# Altium schematic sheet Heater_Driver.SchDoc
size A4; SheetNumber: 6; SheetTotal: 8
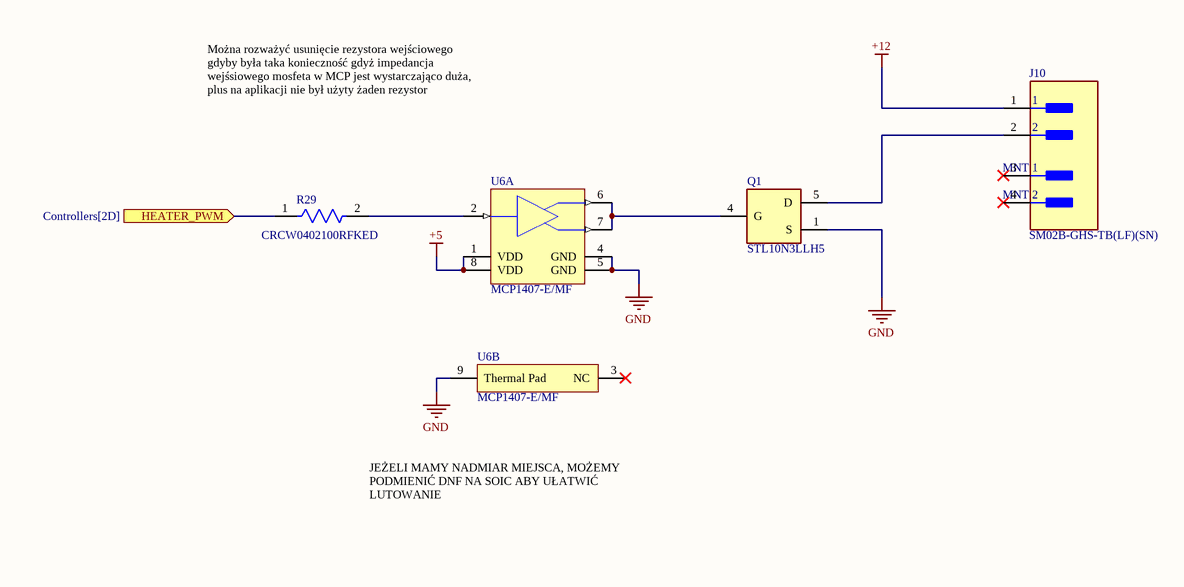
[diagram p0: Heater_Driver.SchDoc]

## Parts
J10  SM02B-GHS-TB(LF)(SN)  [FP-SM02B-GHS-TB_LF_SN-MFG]
Q1  STL10N3LLH5  [STL10N3LLH5]
R29  CRCW0402100RFKED  [FP-CRCW0402-e3-IPC_C]
U6  MCP1407-E/MF  [DFNS-MF8]  (parts A,B of 2)

## Ports
HEATER_PWM (in, see Controllers[2D])

## Nets
+5: U6.1(VDD) U6.8(VDD)
+12: J10.1
GND: Q1.1(S) U6.4(GND) U6.5(GND) U6.9(Thermal_Pad)
HEATER_PWM: R29.1 ; port HEATER_PWM
NetJ10_2: J10.2 Q1.5(D)
NetQ1_4: Q1.4(G) U6.6(OUT) U6.7(OUT)
NetR29_2: R29.2 U6.2(IN)

Not connected (* = marked no-connect by the designer): J10 3(MNT_1)* 4(MNT_2)*; U6 3(NC)*

## Notes on the sheet
- Można rozważyć usunięcie rezystora wejściowego gdyby była taka konieczność gdyż impedancja wejśsiowego mosfeta w MCP jest wystarczająco duża, plus na aplikacji nie był użyty żaden rezystor
- JEŻELI MAMY NADMIAR MIEJSCA, MOŻEMY PODMIENIĆ DNF NA SOIC ABY UŁATWIĆ LUTOWANIE

## Library data of the parts
J10 = CMP-2000-07076-2: CONN HEADER SMD R/A 2POS 1.25MM; Voltage Rating: 50V; Number of Positions: 2; Pitch: 0.049inch; Current Rating: 1A; Connector Type: Outer Shroud Contact; Number of Rows: 1; Contact Material: Bronze; Termination: Solder; Color: Natural; Package Quantity: 2500; Mount: Surface Mount; Housing Color: Natural; Number of Contacts: 2; Packaging: Tape and Reel; Lead Free: Lead Free; Housing Material: Nylon; Orientation: Right Angle; Contact Type: Male Pin; Contact Plating: Tin; Series: GH; Fastening Type: Latch
Q1 = STL10N3LLH5: STMICROELECTRONICS - STL10N3LLH5 - MOSFET, N-CH, 30V, 9A, POWERFLAT; pin to pad: 1>1+2+3 5>5+6+7+8+9+10; Geometry.Height: 1mm; Mouser Part Number: 511-STL10N3LLH5; Mouser Price/Stock: https://www.mouser.co.uk/ProductDetail/STMicroelectronics/STL10N3LLH5?qs=0gj%2FgiofzsOGxczN3DPYlA%3D%3D; Manufacturer_Name: STMicroelectronics; Manufacturer_Part_Number: STL10N3LLH5; Datasheet Link: https://www.st.com/resource/en/datasheet/stl10n3llh5.pdf
R29 = CMP-1011-00397-3: RES Thick Film, 100Ω, 1%, 0.063W, 100ppm/°C, 0402; Max Power Dissipation: 63mW; Voltage Rating: 50V; Resistance: 100R; Package Quantity: 10; Lead Free: Lead Free; Termination: SMD/SMT; Case Code (Metric): 1005; Number of Terminations: 2; Composition: Thick Film; Voltage Rating (DC): 50V; Min Operating Temperature: -55°C; Case/Package: 0402; Radiation Hardening: No; Max Operating Temperature: 155°C; Temperature Coefficient: 100ppm/°C; Military Standard: Not; Length: 1mm; Mount: Surface Mount; Power Rating: 63mW; Weight: 2.3E-05oz; Working Voltage: 50V; Features: Automotive AEC-Q200; Depth: 0.5mm; Packaging: Tape and Reel; Tolerance: 1%; Height: 0.35mm; Case Code (Imperial): 0402; Width: 0.02inch; Contact Plating: Tin
U6 = CMP-0137-00335-2: 6A High-Speed Power MOSFET Drivers, Non Inverting, Extended Temperature; PackageDescription: 8-Lead Plastic Dual Flat, No Lead Package (MF) - 6x5 mm Body [DFN-S]; PackageVersion: revBB, Aug-2009; PackageReference: DFNS-MF8; DatasheetVersion: revA, Dec-2006